# EAGLE design SOIC-8-N_to_DIP-8 (EAGLE 8.5.1)
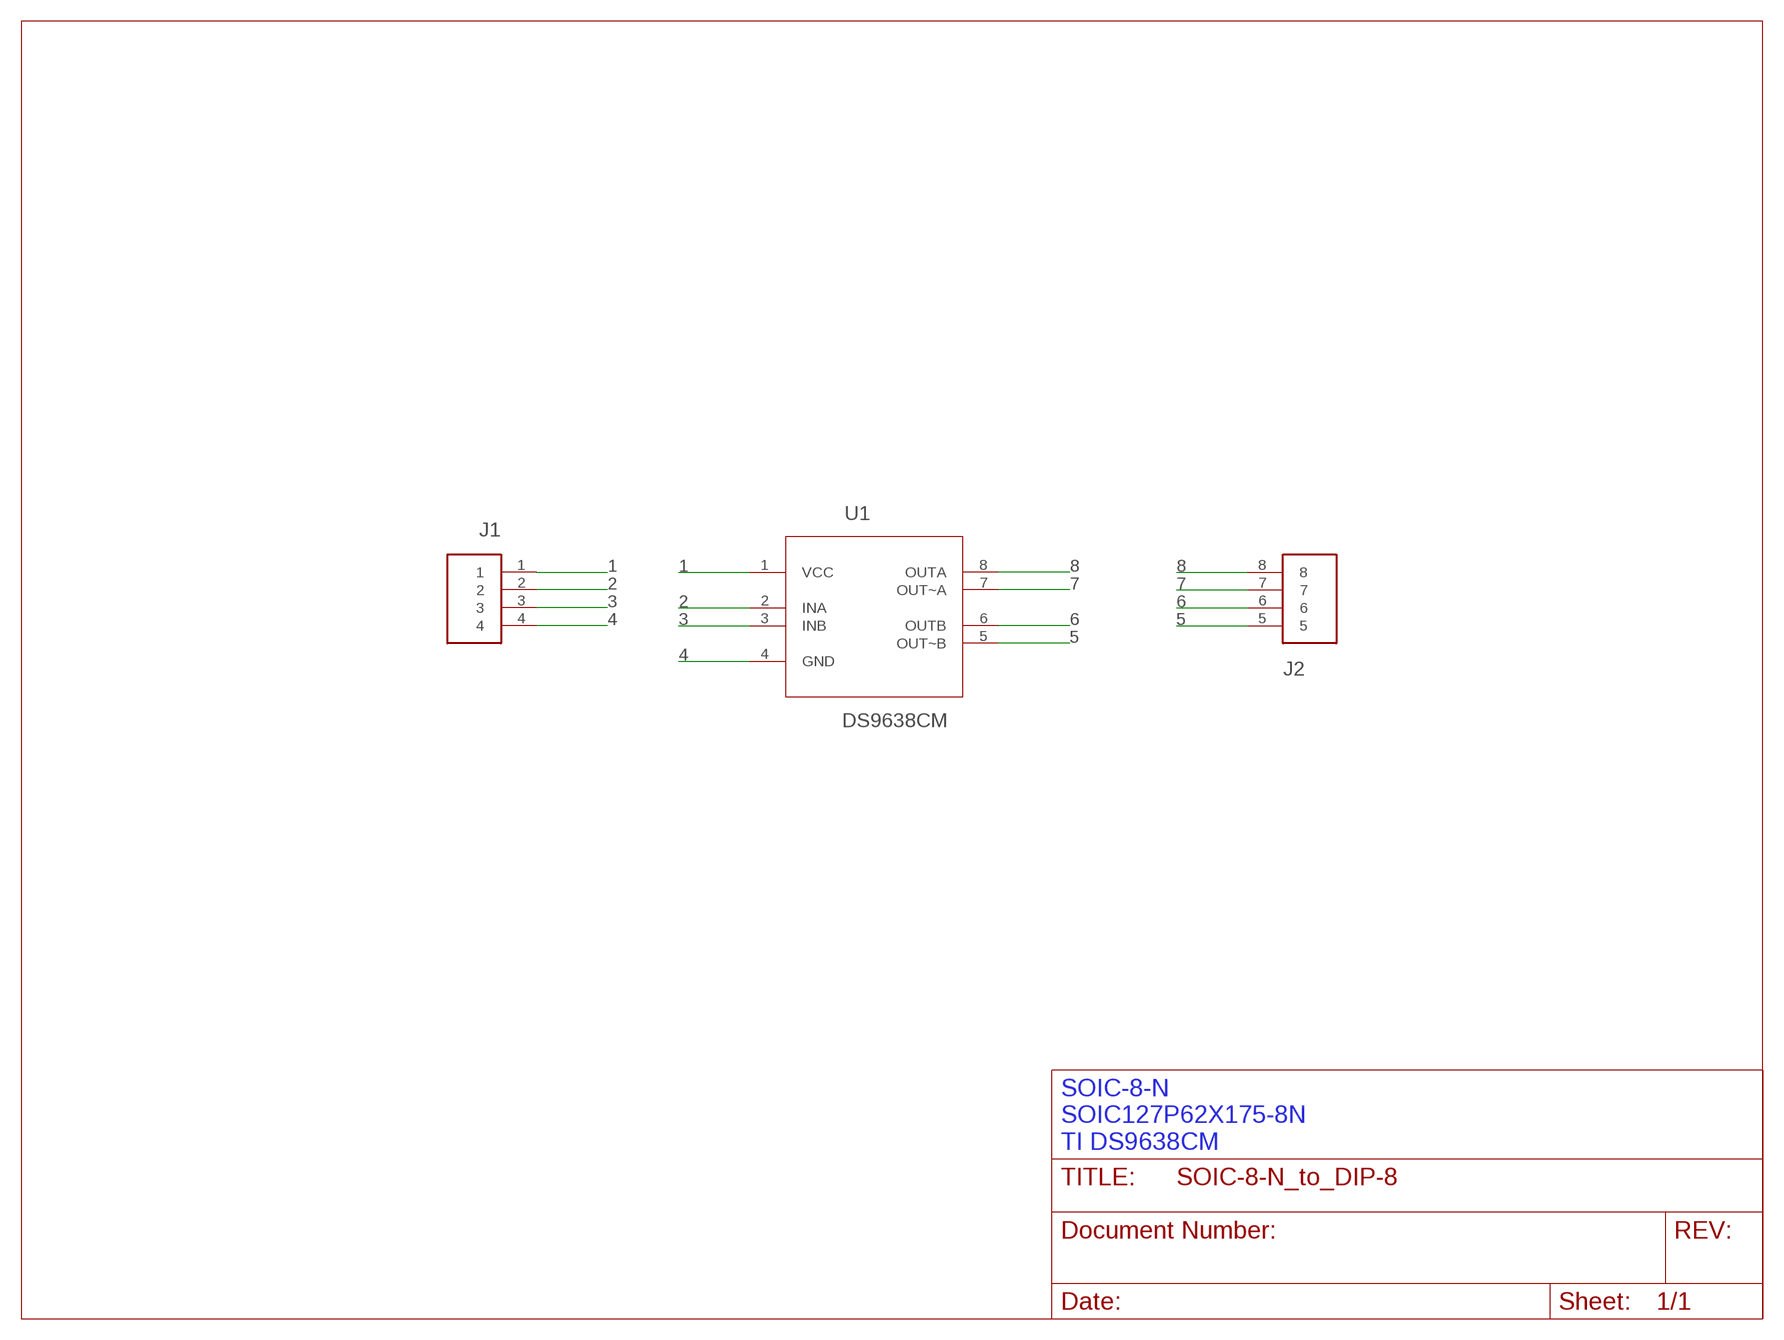
[diagram p0: schematic, sheet 1]

## Parts
J1  CONNECTOR_4-0.100_VERTICAL  [68000-104HLF]
J2  CONNECTOR_4_PINS_5-8  [68000-104HLF_PINS_5-8]
U1  DS9638CM  [SOIC127P62X175-8N]

## Nets
1: J1.1 U1.1(VCC)
2: J1.2 U1.2(INA)
3: J1.3 U1.3(INB)
4: J1.4 U1.4(GND)
5: J2.5 U1.5(OUT~B)
6: J2.6 U1.6(OUTB)
7: J2.7 U1.7(OUT~A)
8: J2.8 U1.8(OUTA)

## Notes on the sheet
- SOIC-8-N
  SOIC127P62X175-8N
  TI DS9638CM

## Library data of the parts
J1 = SnapEDA:CONNECTOR_4
J2 = SnapEDA:CONNECTOR_4_PINS_5-8
U1 = SnapEDA:DS9638CM: RS-422 Dual High Speed Differential Line Driver; AVAILABILITY: Good; DESCRIPTION: DIFF LINE DRIVER, RS422, SOIC-8; Device Type: Differential Line Driver; IC Interf; MF: Texas Instruments; MP: DS9638CM/NOPB; PACKAGE: SOIC-8 Texas Instruments; PRICE: 1.08 USD

## Board
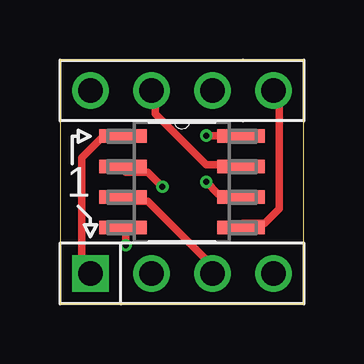
[diagram p1: board, top side]
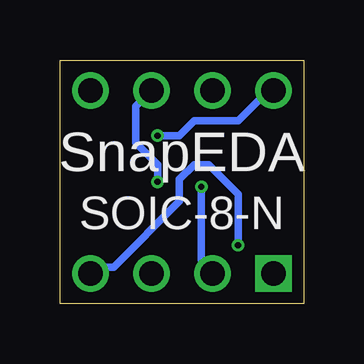
[diagram p2: board, bottom side, seen from below]

Size 10.16 x 10.16 mm. Coordinates in mm from the lower left corner, seen from the top.
Outline: 0,0 10.16,0 10.16,10.16 0,10.16 0,0
Copper layers (1*16): Top 0.035559375mm / dielectric 1.6mm / Bottom 0.035559375mm
Design rules "oshpark-2layer *": minimum track width 12mil, minimum drill 10mil, track to track 12mil, track to pad 12mil, pad to pad 6mil, via to via 6mil, smd to smd 6mil, copper to edge 15mil, drill to drill 6mil, minimum pad ring 5mil, minimum via ring 5mil, stop-mask expansion 2.5mil, vias tented up to drill 0mil, thermal gap 10mil

### Footprints (pad centres in the part's own frame; a part is rotated, then mirrored left to right if it is on the bottom)
68000-104HLF = drill 1.016 square: 1 0,0 | drill 1.016: 2 2.54,0; 3 5.08,0; 4 7.62,0
68000-104HLF_PINS_5-8 = drill 1.016: 5 0,0; 6 2.54,0; 7 5.08,0; 8 7.62,0
SOIC127P62X175-8N = smd 1.981 x 0.559: 1 -2.464,1.905; 2 -2.464,0.635; 3 -2.464,-0.635; 4 -2.464,-1.905; 5 2.464,-1.905; 6 2.464,-0.635; 7 2.464,0.635; 8 2.464,1.905

### Placement (x,y rotation side)
J1  1.27,1.27 0 top
J2  8.89,8.89 180 top
U1  5.08,5.08 0 top

### Tracks (layer width: path | path; a pad name or v marks a point on that pad's centre or on a via)
1
  Top 0.305: U1.1 2.44,7.01 1.83,7.01 0.91,6.1 0.91,1.83 1.22,1.52 J1.1
2  (via drill 0.25)
  Top 0.305: v4.27,4.88 3.66,5.49 2.74,5.49 U1.2
  Bottom 0.305: v4.27,4.88 4.27,1.83 3.96,1.52 J1.2
3
  Top 0.305: U1.3 2.74,4.27 3.66,4.27 6.4,1.52 J1.3
4  (via drill 0.25)
  Top 0.305: v2.74,2.44 2.74,3.05 U1.4
  Bottom 0.305: v2.74,2.44 2.74,4.57 3.96,5.79 4.57,5.79 5.18,5.18 5.18,4.27 7.92,1.52 8.84,1.52 J1.4
5
  Top 0.305: U1.5 7.62,3.35 8.53,3.35 9.14,3.96 9.14,8.84 J2.5
6  (via drill 0.25)
  Top 0.305: v6.1,5.08 6.6,4.57 7.32,4.57 U1.6
  Bottom 0.305: v6.1,5.08 6.1,5.79 7.01,6.71 7.01,8.23 J2.6
7
  Top 0.305: U1.7 7.32,5.79 6.1,5.79 3.96,7.92 3.96,8.84 J2.7
8  (via drill 0.25)
  Top 0.305: v6.1,7.01 7.32,7.01 U1.8
  Bottom 0.305: v6.1,7.01 5.18,7.01 4.57,7.62 2.74,7.62 1.52,8.84 J2.8

### Text on the board
tPlace: 1
bPlace: SnapEDA | SOIC-8-N